# EAGLE schematic P20-Receptor_Transmisor_NRF24I01 (EAGLE 9.6.2)
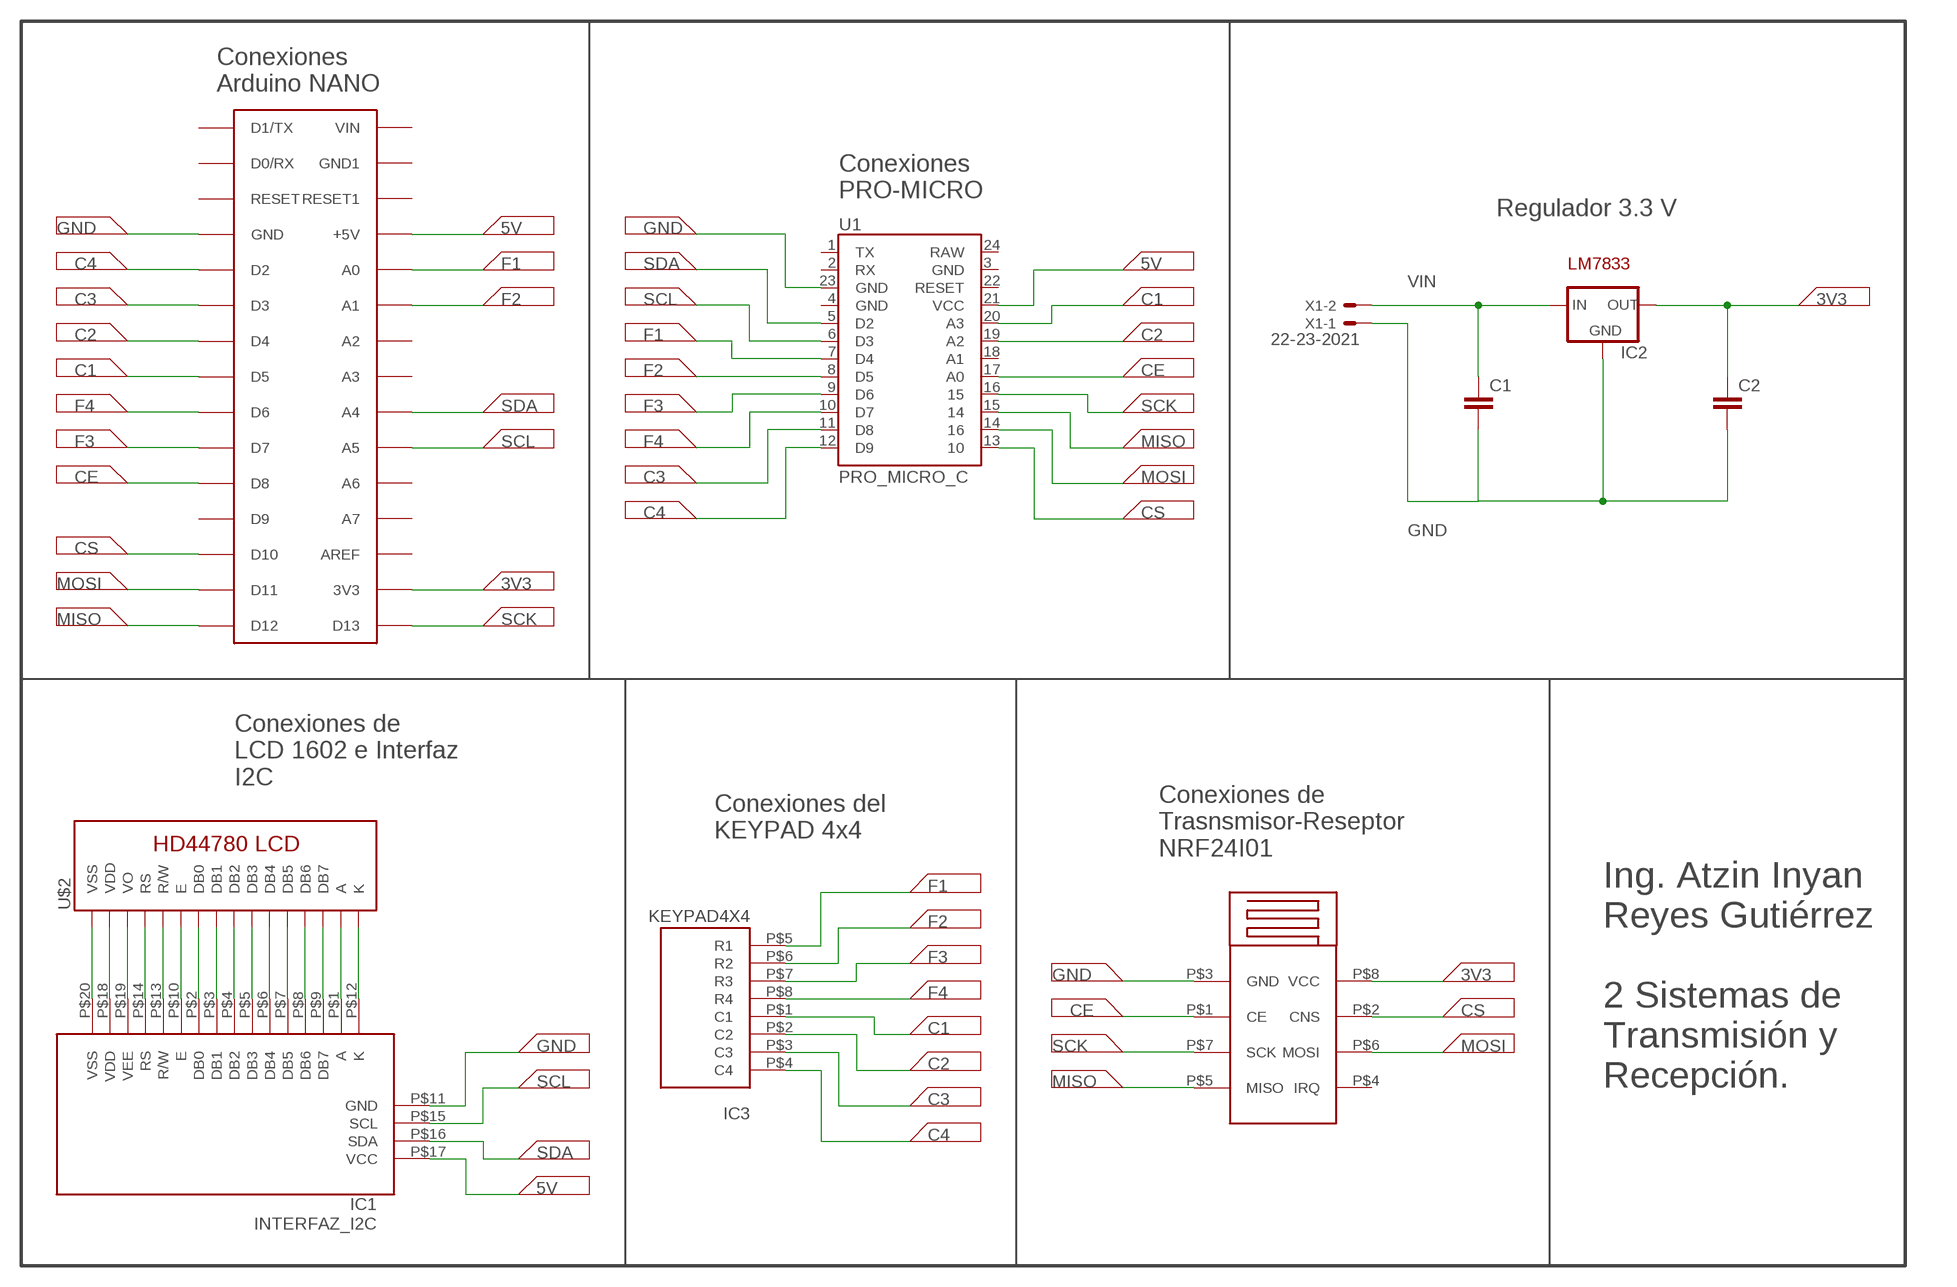
[diagram p0: schematic, sheet 1]

## Parts
C1  C2,5-3  [C2.5-3]
C2  C2,5-3  [C2.5-3]
IC1  INTERFAZ_I2C  [NO_FOOTPRINT]
IC2  78MXXL  [78MXXL]
IC3  KEYPAD4X4  [NO_FOOTPRINT]
U1  PRO_MICRO_C  [PRO_MICRO_C]
U$1  ARDUINONANO  [PDIP-32]
U$2  LCD-HD447803-HOLES16X2-3-HOLES  [LCD-16X2-3HOLES]
U$3  NRF24I01  [NOT_FOOTPRINT]
X1  22-23-2021  [22-23-2021]

## Nets
3V3: C2.1 IC2.OUT U$1.3V3 U$3.P$8(VCC)
5V: IC1.P$17(VCC) U1.21(VCC) U$1.+5V
C1: IC3.P$1(C1) U1.20(A3) U$1.D5
C2: IC3.P$2(C2) U1.19(A2) U$1.D4
C3: IC3.P$3(C3) U1.11(D8) U$1.D3
C4: IC3.P$4(C4) U1.12(D9) U$1.D2
CE: U1.17(A0) U$1.D8 U$3.P$1(CE)
CS: U1.13 U$1.D10 U$3.P$2(CNS)
F1: IC3.P$5(R1) U1.7(D4) U$1.A0
F2: IC3.P$6(R2) U1.8(D5) U$1.A1
F3: IC3.P$7(R3) U1.9(D6) U$1.D7
F4: IC3.P$8(R4) U1.10(D7) U$1.D6
GND: C1.2 C2.2 IC1.P$11(GND) IC2.GND U1.23(GND) U$1.GND U$3.P$3(GND) X1.1
MISO: U1.15 U$1.D12 U$3.P$5(MISO)
MOSI: U1.14 U$1.D11 U$3.P$6(MOSI)
N$1: IC1.P$20(VSS) U$2.1(VSS)
N$2: IC1.P$18(VDD) U$2.2(VDD)
N$3: IC1.P$19(VEE) U$2.3(VO)
N$4: IC1.P$14(RS) U$2.4(RS)
N$5: IC1.P$13(R/W) U$2.5(R/W)
N$6: IC1.P$10(E) U$2.6(E)
N$7: IC1.P$2(DB0) U$2.7(DB0)
N$8: IC1.P$3(DB1) U$2.8(DB1)
N$9: IC1.P$4(DB2) U$2.9(DB2)
N$10: IC1.P$5(DB3) U$2.10(DB3)
N$11: IC1.P$6(DB4) U$2.11(DB4)
N$12: IC1.P$7(DB5) U$2.12(DB5)
N$13: IC1.P$8(DB6) U$2.13(DB6)
N$14: IC1.P$9(DB7) U$2.14(DB7)
N$15: IC1.P$1(A) U$2.15(A)
N$16: IC1.P$12(K) U$2.16(K)
SCK: U1.16 U$1.D13 U$3.P$7(SCK)
SCL: IC1.P$15(SCL) U1.6(D3) U$1.A5
SDA: IC1.P$16(SDA) U1.5(D2) U$1.A4
VIN: C1.1 IC2.IN X1.2
Unconnected: U1.1(TX) U1.2(RX) U1.3(GND) U1.4(GND) U1.18(A1) U1.22(RESET) U1.24(RAW) U$1.A2 U$1.A3 U$1.A6 U$1.A7 U$1.AREF U$1.D0/RX U$1.D1/TX U$1.D9 U$1.GND1 U$1.RESET U$1.RESET1 U$1.VIN U$3.P$4(IRQ)

## Notes on the sheet
- Conexiones
  Arduino NANO
- Conexiones
  PRO-MICRO
- Regulador 3.3 V
- LM7833
- Conexiones de
  LCD 1602 e Interfaz
  I2C
- Conexiones del
  KEYPAD 4x4
- Conexiones de 
  Trasnsmisor-Reseptor
  NRF24I01
- Ing. Atzin Inyan
  Reyes Gutiérrez
  
  2 Sistemas de
  Transmisión y
  Recepción.

## Library data of the parts
C1 C2 = capacitor-wima:C: CAPACITOR naming: grid - package width
IC1 = Interfaz_I2C:INTERFAZ_I2C
IC2 = v-reg-3:78MXXL: VOLTAGE REGULATOR
IC3 = keypad_4x4:KEYPAD4X4
U1 = SparkFun-Boards:PRO_MICRO_C
U$1 = jet-lib:ARDUINONANO
U$2 = HD44780LCD:LCD-HD44780
U$3 = NRF24I01:NRF24I01
X1 = con-molex:22-23-2021: .100" (2.54mm) Center Header - 2 Pin; MF: MOLEX; MPN: 22-23-2021; OC_FARNELL: 1462926; OC_NEWARK: 25C3832